# Altium project Driver_Display.PrjPcb (part 1 of 2)
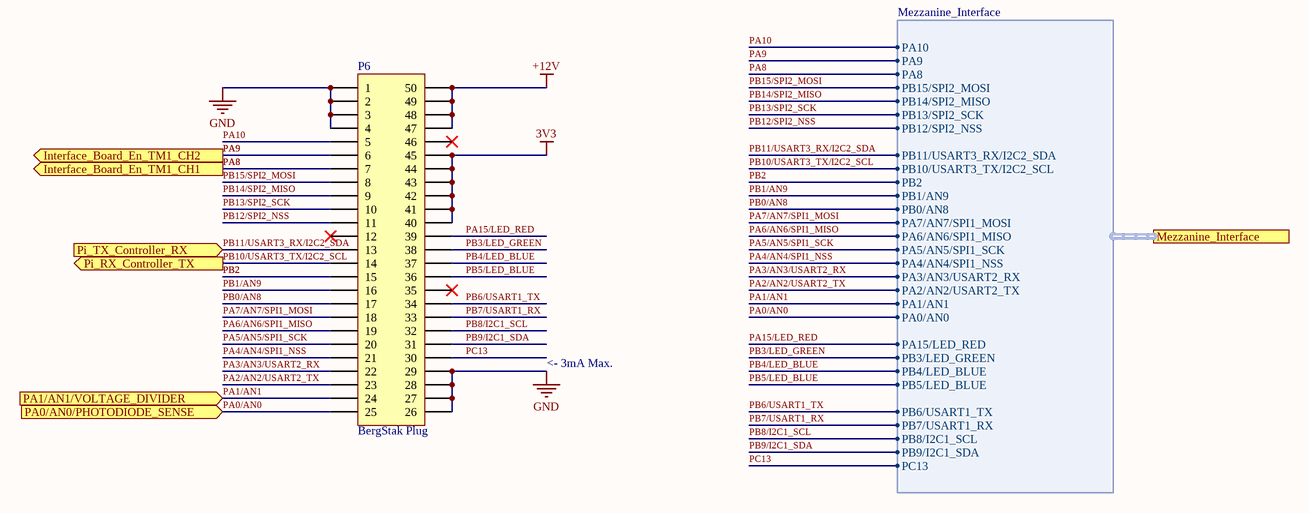
[diagram p0: Controller_Board_Interface.SchDoc]
ProjectAuthor: Kelly Tang; ProjectRevision: 1.0
5 sheets, 41 parts. Net scope: flat (ports and power ports of the same name join across sheets).
Board file: Driver_Display_Board.PcbDoc
Sheets:
  Controller_Board_Interface.SchDoc
  Voltage Regulator.SchDoc
  RTC.SchDoc
  Ambient Light Sensor.SchDoc
  Connectors.SchDoc

## Sheet Controller_Board_Interface.SchDoc
size Letter; Website: www.uwmidsun.com

### Parts
P6  Series: BergStak Plug  [CONN, Bergstak 50 Pos Plug]  (hidden comment: CONN 50POS Bergstak Plug 0.02")

### Ports
Interface_Board_En_TM1_CH1 (out), Interface_Board_En_TM1_CH2 (out), Mezzanine_Interface (harness Mezzanine_Interface), PA0/AN0/PHOTODIODE_SENSE (in), PA1/AN1/VOLTAGE_DIVIDER (in), Pi_RX_Controller_TX (out), Pi_TX_Controller_RX (in)

### Harnesses
Mezzanine_Interface: PA10, PA9, PA8, PB15/SPI2_MOSI, PB14/SPI2_MISO, PB13/SPI2_SCK, PB12/SPI2_NSS, PB11/USART3_RX/I2C2_SDA, PB10/USART3_TX/I2C2_SCL, PB2, PB1/AN9, PB0/AN8, PA7/AN7/SPI1_MOSI, PA6/AN6/SPI1_MISO, PA5/AN5/SPI1_SCK, PA4/AN4/SPI1_NSS, PA3/AN3/USART2_RX, PA2/AN2/USART2_TX, PA1/AN1, PA0/AN0, PA15/LED_RED, PB3/LED_GREEN, PB4/LED_BLUE, PB5/LED_BLUE, PB6/USART1_TX, PB7/USART1_RX, PB8/I2C1_SCL, PB9/I2C1_SDA, PC13

### Nets
3V3: P6.40 P6.41 P6.42 P6.43 P6.44 P6.45
+12V: P6.47 P6.48 P6.49 P6.50
GND: P6.1 P6.2 P6.3 P6.4 P6.26 P6.27 P6.28 P6.29
PA0/AN0: P6.25 ; port PA0/AN0/PHOTODIODE_SENSE, port Mezzanine_Interface.PA0/AN0
PA1/AN1: P6.24 ; port PA1/AN1/VOLTAGE_DIVIDER, port Mezzanine_Interface.PA1/AN1
PA2/AN2/USART2_TX: P6.23 ; port Mezzanine_Interface.PA2/AN2/USART2_TX
PA3/AN3/USART2_RX: P6.22 ; port Mezzanine_Interface.PA3/AN3/USART2_RX
PA4/AN4/SPI1_NSS: P6.21 ; port Mezzanine_Interface.PA4/AN4/SPI1_NSS
PA5/AN5/SPI1_SCK: P6.20 ; port Mezzanine_Interface.PA5/AN5/SPI1_SCK
PA6/AN6/SPI1_MISO: P6.19 ; port Mezzanine_Interface.PA6/AN6/SPI1_MISO
PA7/AN7/SPI1_MOSI: P6.18 ; port Mezzanine_Interface.PA7/AN7/SPI1_MOSI
PA8: P6.7 ; port Interface_Board_En_TM1_CH1, port Mezzanine_Interface.PA8
PA9: P6.6 ; port Interface_Board_En_TM1_CH2, port Mezzanine_Interface.PA9
PA10: P6.5 ; port Mezzanine_Interface.PA10
PA15/LED_RED: P6.39 ; port Mezzanine_Interface.PA15/LED_RED
PB0/AN8: P6.17 ; port Mezzanine_Interface.PB0/AN8
PB1/AN9: P6.16 ; port Mezzanine_Interface.PB1/AN9
PB2: P6.15 ; port Mezzanine_Interface.PB2
PB3/LED_GREEN: P6.38 ; port Mezzanine_Interface.PB3/LED_GREEN
PB4/LED_BLUE: P6.37 ; port Mezzanine_Interface.PB4/LED_BLUE
PB5/LED_BLUE: P6.36 ; port Mezzanine_Interface.PB5/LED_BLUE
PB6/USART1_TX: P6.34 ; port Mezzanine_Interface.PB6/USART1_TX
PB7/USART1_RX: P6.33 ; port Mezzanine_Interface.PB7/USART1_RX
PB8/I2C1_SCL: P6.32 ; port Mezzanine_Interface.PB8/I2C1_SCL
PB9/I2C1_SDA: P6.31 ; port Mezzanine_Interface.PB9/I2C1_SDA
PB10/USART3_TX/I2C2_SCL: P6.14 ; port Pi_RX_Controller_TX, port Mezzanine_Interface.PB10/USART3_TX/I2C2_SCL
PB11/USART3_RX/I2C2_SDA: P6.13 ; port Pi_TX_Controller_RX, port Mezzanine_Interface.PB11/USART3_RX/I2C2_SDA
PB12/SPI2_NSS: P6.11 ; port Mezzanine_Interface.PB12/SPI2_NSS
PB13/SPI2_SCK: P6.10 ; port Mezzanine_Interface.PB13/SPI2_SCK
PB14/SPI2_MISO: P6.9 ; port Mezzanine_Interface.PB14/SPI2_MISO
PB15/SPI2_MOSI: P6.8 ; port Mezzanine_Interface.PB15/SPI2_MOSI
PC13: P6.30 ; port Mezzanine_Interface.PC13

Not connected (* = marked no-connect by the designer): P6 12* 35* 46*

### Notes on the sheet
- <- 3mA Max.
- Project:
- Title:
- Size:
- Project Lead:
- Letter
- Revision:
- University of Waterloo
- 200 University Ave W
- Waterloo, ON, Canada
- N2L 3E9
- Date:
- Sheet
- of
- Website:

### Library data of the parts
P6 = CONN 50POS Bergstak Plug 0.02": 50 Position Connector Plug, Outer Shroud Contacts Surface Mount Gold; Manufacturer 1: Amphenol FCI; Manufacturer Part Number 1: 10132797-055100LF; Number of Positions: 50; Mated Stacking Heights: 5mm; Pitch: 0.020" (0.50mm); Supplier 1: Digi-Key; Supplier Part Number 1: 609-5226-1-ND; Packaging: Cut Tape (CT); Part Status: Active; Connector Type: Plug, Outer Shroud Contacts; Number of Rows: 2; Mounting Type: Surface Mount; Contact Finish: Gold; Contact Finish Thickness: 1µin (0.025µm); Height Above Board: 0.169" (4.30mm); ComponentLink1URL: http://portal.fciconnect.com/Comergent//fci/drawing/10132797.pdf; ComponentLink1Description: http://portal.fciconnect.com/Comergent//fci/drawing/10132797.pdf

## Sheet Voltage Regulator.SchDoc
size Letter; Organization: Midnight Sun Solar Rayce Car Team; Address1: University of Waterloo; Address2: 200 University Ave W; Address3: Waterloo, ON, Canada; Address4: N2L 3E9; Website: www.uwmidsun.com
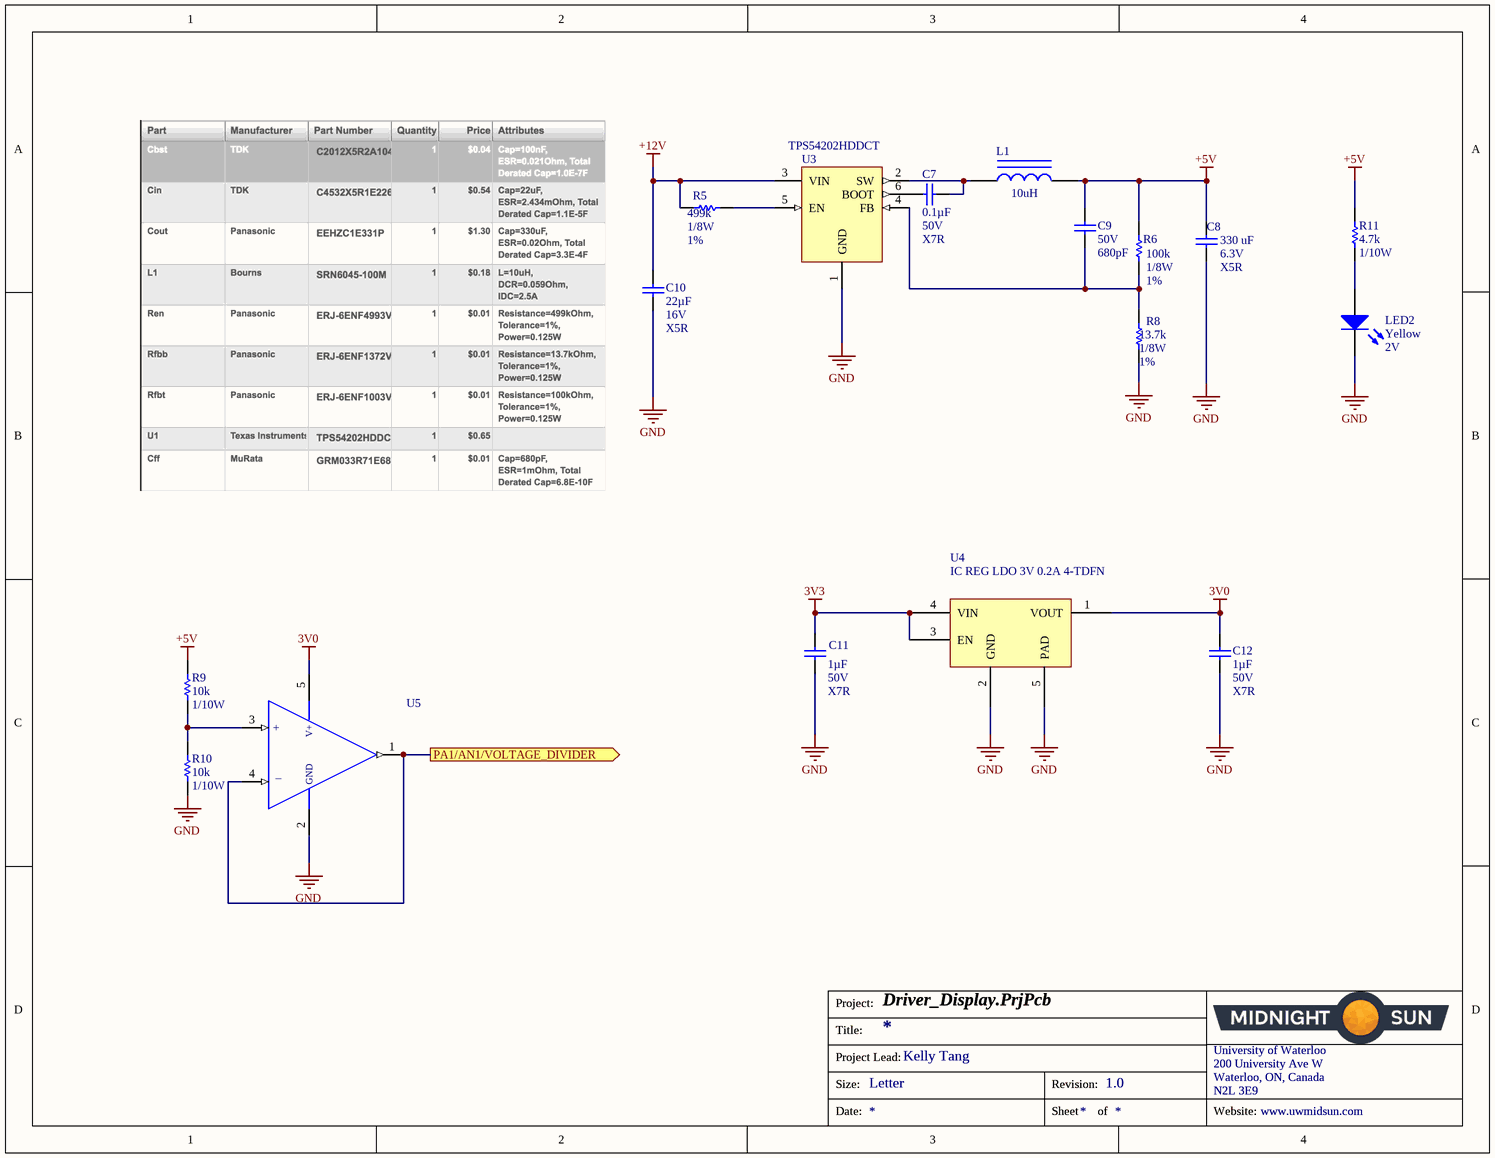
[diagram p1: Voltage Regulator.SchDoc]

### Parts
C7  Capacitance: 0.1µF  Voltage: 50V  Temperature Coefficient: X7R  [CAP, 0603]  (hidden comment: CAP CER 0.1UF 50V 10% X7R 0603)
C8  Capacitance: 330 uF  Voltage: 6.3V  Temperature Coefficient: X5R  [CAP, 1210]  (hidden comment: CAP CER 330UF 6.3V X5R 1210)
C9  Voltage: 50V  Capacitance: 680pF  [CAP, 0603]  (hidden comment: CAP CER 680PF 50V C0G/NP0 0603)
C10  Capacitance: 22µF  Voltage: 16V  Temperature Coefficient: X5R  [CAP, 1210]  (hidden comment: CAP CER 22UF 16V ±20% X5R 1210)
C11  Capacitance: 1µF  Voltage: 50V  Temperature Coefficient: X7R  [CAP, 0603]  (hidden comment: CAP CER 1UF 50V 10% X7R 0603)
C12  Capacitance: 1µF  Voltage: 50V  Temperature Coefficient: X7R  [CAP, 0603]  (hidden comment: CAP CER 1UF 50V 10% X7R 0603)
L1  Inductance: 10uH  [INDP100102X31N]  (hidden comment: IND 10UH 2.8A 59 MOHM SMD)
LED2  Color: Yellow  Voltage - Forward (Vf) (Typ): 2V  [LED_0603]  (hidden comment: LED YELLOW CLEAR 2.1V 0603)
R5  Resistance: 499k  Tolerance: 1%  Max Power Dissipation: 1/8W  [RES 1206]  (hidden comment: RES 499K OHM 1% 1/4W 1206)
R6  Tolerance: 1%  Resistance: 100k  Power Rating: 1/8W  [RES 1206]  (hidden comment: ES 100K OHM 1% 1/4W 1206)
R8  Resistance: 13.7k  Tolerance: 1%  Power Rating: 1/8W  [RES 1206]  (hidden comment: RES 13.7K OHM 1% 1/4W 1206)
R9  Resistance: 10k  Power: 1/10W  [RES, 0603]  (hidden comment: RES 10K OHM 1% 1/10W 0603)
R10  Resistance: 10k  Power: 1/10W  [RES, 0603]  (hidden comment: RES 10K OHM 1% 1/10W 0603)
R11  Resistance (Ohms): 4.7k  Power (Watts): 1/10W  [RES, 0603]  (hidden comment: RES 4.7K OHM 1% 1/10W 0603)
U3  Manufacturer Part Number: TPS54202HDDCT  [SOT23-6]  (hidden comment: IC REG BUCK ADJ 2A SYNC 6SOT)
U4  IC REG LDO 3V 0.2A 4-TDFN  [IC REG LDO 3V 0.2A 4-TDFN]
U5  IC OP AMP GEN PURPOSE RR 10MHZ SOT-23-5  [IC OP AMP GP RR 10MHZ SOT-23-5]  (value not drawn)

### Ports
PA1/AN1/VOLTAGE_DIVIDER (out)

### Nets
3V0: C12.1 U4.1(VOUT) U5.5(VDD)
3V3: C11.1 U4.3(EN) U4.4(VIN)
+5V: C8.1 C9.1 L1.2 R6.1 R9.1 R11.1
+12V: C10.1 R5.2 U3.3(VIN)
GND: C8.2 C10.2 C11.2 C12.2 LED2.2(K) R8.2 R10.2 U3.1(GND) U4.2(GND) U4.5(PAD) U5.2(VSS)
PA1/AN1: U5.1(OUTPUT) U5.4(-IN) ; port PA1/AN1/VOLTAGE_DIVIDER
NetC7_1: C7.1 U3.6(BOOT)
NetC7_2: C7.2 L1.1 U3.2(SW)
NetC9_2: C9.2 R6.2 R8.1 U3.4(FB)
NetLED2_1: LED2.1(A) R11.2
NetR5_1: R5.1 U3.5(EN)
NetR9_2: R9.2 R10.1 U5.3(+IN)

### Notes on the sheet
- Project:
- Title:
- Size:
- Project Lead:
- Letter
- Revision:
- University of Waterloo
- 200 University Ave W
- Waterloo, ON, Canada
- N2L 3E9
- Date:
- Sheet
- of
- Website:
- (in symbol IC OP AMP GEN PURPOSE RR 10MHZ SOT-23-5) V+; +; GND; _

### Library data of the parts
C7 = CAP CER 0.1UF 50V 10% X7R 0603: 0.10µF ±10% 50V Ceramic Capacitor X7R 0603 (1608 Metric); Manufacturer 1: AVX Corporation; Manufacturer Part Number 1: 06035C104KAT2A; Supplier 1: Digi-Key; Supplier Part Number 1: 478-5052-1-ND; Packaging: Cut Tape (CT); Part Status: Active; Operating Temperature: -55°C ~ 125°C; Ratings: -; Mounting Type: Surface Mount, MLCC; Package / Case: 0603 (1608 Metric); Size / Dimension: 0.063" L x 0.032" W (1.60mm x 0.81mm); Height - Seated (Max): -; Thickness (Max): 0.035" (0.90mm); Lead Spacing: -; Lead Style: -; ComponentLink1URL: http://datasheets.avx.com/X7RDielectric.pdf; ComponentLink1Description: http://datasheets.avx.com/X7RDielectric.pdf; Tolerance: ±10%
C8 = CAP CER 330UF 6.3V X5R 1210: 330µF ±20% 6.3V Ceramic Capacitor X5R 1210 (3225 Metric); Manufacturer: Taiyo Yuden; Manufacturer Part Number: JMK325ABJ337MM-P; Supplier 1: Digi-Key; Stock 1: 334; Pricing 1: 1=5.57, 10=4.492, 100=3.5039, 500=2.60546 (USD); ComponentLink1URL: http://ds.yuden.co.jp/TYCOMPAS/ut/detail.do?productNo=JMK325ABJ337MM-P&fileName=JMK325ABJ337MM-P_SS&mode=specSheetDownload; ComponentLink1Description: http://ds.yuden.co.jp/TYCOMPAS/ut/detail.do?productNo=JMK325ABJ337MM-P&fileName=JMK325ABJ337MM-P_SS&mode=specSheetDownload; Supplier Part Number 1: 587-5449-1-ND
C9 = CAP CER 680PF 50V C0G 0603: 680pF ±5% 50V Ceramic Capacitor C0G, NP0 0603 (1608 Metric); Manufacturer: Samsung; Manufacturer Part Number: CL10C681JB8NNNC; Temperature Coefficient: 300ppm/°C; Supplier 1: Digi-Key; Stock 1: 40000; Pricing 1: 1=0.16, 10=0.112, 100=0.0526, 500=0.0369, 1000=0.03055 (USD); Mount: Surface Mount; Case/Package: 0603; Case Code (Metric): 1608; Case Code (Imperial): 0603; Material: Ceramic; Min Operating Temperature: -55°C; Max Operating Temperature: 125°C; Tolerance: 5%; Packaging: Tape and Reel; Voltage Rating: 50V; Dielectric: C0G; Voltage Rating (DC): 50V; Length: 1.6mm; Height: 0.8mm; Width: 0.031inch; Thickness: 0.035inch; Depth: 0.8mm; Radiation Hardening: No; Lead Free: Lead Free; ComponentLink1URL: http://www.samsungsem.com/kr/support/product-search/mlcc/CL10C681JB8NNNC.jsp; ComponentLink1Description: http://www.samsungsem.com/kr/support/product-search/mlcc/CL10C681JB8NNNC.jsp; ComponentLink2URL: https://www.verical.com/server-webapp/html/getDatasheet?partID=359565; ComponentLink2Description: https://www.verical.com/server-webapp/html/getDatasheet?partID=359565; ComponentLink3URL: http://www1.futureelectronics.com/doc/SAMSUNG%20PASSIVE/CL05B104KQ5NNNC.pdf; ComponentLink3Description: http://www1.futureelectronics.com/doc/SAMSUNG%20PASSIVE/CL05B104KQ5NNNC.pdf; ComponentLink4URL: http://www.rapidonline.com/pdf/71-0310.pdf; ComponentLink4Description: http://www.rapidonline.com/pdf/71-0310.pdf; ComponentLink5URL: https://www.distrelec.biz/Web/Downloads/_e/ng/MLCC_CatalogDownload2013_ENG.pdf?mime=application%2Fpdf; ComponentLink5Description: https://www.distrelec.biz/Web/Downloads/_e/ng/MLCC_CatalogDownload2013_ENG.pdf?mime=application%2Fpdf; ComponentLink6URL: https://produktinfo.conrad.com/datenblaetter/450000-474999/456146-da-01-en-VS_KONDENSATOR_0603.pdf; ComponentLink6Description: https://produktinfo.conrad.com/datenblaetter/450000-474999/456146-da-01-en-VS_KONDENSATOR_0603.pdf; Supplier Part Number 1: 1276-1820-1-ND
C10 = CAP CER 22UF 16V ±20% X5R 1210: 22µF ±20% 16V Ceramic Capacitor X5R 1210 (3225 Metric); Manufacturer 1: Murata Electronics North America; Manufacturer Part Number 1: GRM32ER61C226ME20L; Supplier 1: Digi-Key; Supplier Part Number 1: 490-1881-1-ND; Packaging: Cut Tape (CT); Part Status: Active; Operating Temperature: -55°C ~ 85°C; Ratings: -; Mounting Type: Surface Mount, MLCC; Package / Case: 1210 (3225 Metric); Size / Dimension: 0.126" L x 0.098" W (3.20mm x 2.50mm); Height - Seated (Max): -; Thickness (Max): 0.106" (2.70mm); Lead Spacing: -; Lead Style: -; ComponentLink1URL: http://www.murata.com/~/media/webrenewal/support/library/catalog/products/capacitor/mlcc/c02e.ashx; ComponentLink1Description: http://www.murata.com/~/media/webrenewal/support/library/catalog/products/capacitor/mlcc/c02e.ashx; Tolerance: ±20%
C11 C12 = CAP CER 1UF 50V 10% X7R 0603: 1µF ±10% 50V Ceramic Capacitor X7R 0603 (1608 Metric); Manufacturer 1: Taiyo Yuden; Manufacturer Part Number 1: UMK107AB7105KA-T; Supplier 1: Digi-Key; Supplier Part Number 1: 587-3247-1-ND; Packaging: Cut Tape (CT); Part Status: Active; Operating Temperature: -55°C ~ 125°C; Ratings: -; Mounting Type: Surface Mount, MLCC; Package / Case: 0603 (1608 Metric); Size / Dimension: 0.063" L x 0.031" W (1.60mm x 0.80mm); Height - Seated (Max): -; Thickness (Max): 0.037" (0.95mm); Lead Spacing: -; Lead Style: -; ComponentLink1URL: http://www.yuden.co.jp/productdata/catalog/en/mlcc_all_e.pdf; ComponentLink1Description: http://www.yuden.co.jp/productdata/catalog/en/mlcc_all_e.pdf; Tolerance: ±10%
L1 = IND 10UH 2.8A 59 MOHM SMD: 10µH Shielded Inductor 2.8A 59 mOhm Max Nonstandard; Manufacturer: Sumida; Manufacturer Part Number: CDRH103RNP-100NC-B; Core Material: Ferrite; Tolerance: 30%; Saturation Current: 3.18A; DC Resistance (DCR): 59mR; Test Frequency: 100kHz; Supplier 1: Digi-Key; Stock 1: 69; Pricing 1: 1=1.53, 10=1.42, 100=1.027, 500=0.7866 (USD); Mount: Surface Mount; Case/Package: Nonstandard; Min Operating Temperature: -40°C; Max Operating Temperature: 100°C; Packaging: Tape and Reel; Package Quantity: 1000; Current Rating: 2.8A; Shielding: Shielded; Max DC Current: 2.8A; Termination: SMD/SMT; Length: 0.402inch; Height: 3.1mm; Width: 0.394inch; Height - Seated (Max): 0.122inch; Depth: 10.3mm; Radiation Hardening: No; Lead Free: Lead Free; ComponentLink1URL: http://www.mouser.com/ds/2/390/CDRH103R-523372.pdf; ComponentLink1Description: http://www.mouser.com/ds/2/390/CDRH103R-523372.pdf; ComponentLink2URL: http://www.sumida.com/products/pdf/CDRH103R.pdf; ComponentLink2Description: http://www.sumida.com/products/pdf/CDRH103R.pdf; ComponentLink3URL: http://products.sumida.com/products/pdf/CDRH103R.pdf; ComponentLink3Description: http://products.sumida.com/products/pdf/CDRH103R.pdf; Supplier Part Number 1: 308-1910-1-ND
LED2 = LED YELLOW CLEAR 2.1V 0603: Yellow 590nm LED Indication - Discrete 2V 0603 (1608 Metric); Manufacturer: Wurth Electronics Inc.; Manufacturer Part Number: 150060YS75000; Lens Color: Colorless; Millicandela Rating: 120mcd; Lens Style/Size: Rectangle with Flat Top, 1.10mm x 0.70mm; Current - Test: 20mA; Viewing Angle: 140°; Wavelength - Peak: 595nm; Supplier 1: Digi-Key; RoHS: RoHS Compliant; Category: Optoelectronics; Stock 1: 10523; Pricing 1: 1=0.21, 100=0.1617, 500=0.13964 (CAD); Packaging: Cut Tape (CT); Part Status: Active; Lens Transparency: Clear; Mounting Type: Surface Mount; Wavelength - Dominant: 590nm; Features: -; Package / Case: 0603 (1608 Metric); Supplier Device Package: 0603; Size / Dimension: 1.60mm L x 0.80mm W; Height (Max): 0.80mm; ComponentLink1URL: http://katalog.we-online.de/led/datasheet/150060YS75000.pdf; ComponentLink1Description: http://katalog.we-online.de/led/datasheet/150060YS75000.pdf; Supplier Part Number 1: 732-4981-1-ND
R5 = RES 499K OHM 1% 1/4W 1206: Manufacturer: Stackpole Electronics; Manufacturer Part Number: RMCF1206FT499K; Temperature Coefficient: 100ppm/°C; Supplier 1: Digi-Key; Stock 1: 60246; Pricing 1: 1=0.1, 10=0.035, 100=0.0141, 1000=0.00635, 2500=0.00552 (USD); Mount: Surface Mount; Case/Package: 1206; Case Code (Metric): 3216; Case Code (Imperial): 1206; Contact Plating: Tin,Matte; Min Operating Temperature: -55°C; Max Operating Temperature: 155°C; Packaging: Tape and Reel; Composition: Thick Film; Number of Terminations: 2; Length: 0.126inch; Height: 0.028inch; Width: 0.063inch; Radiation Hardening: No; ComponentLink1URL: https://www.seielect.com/Catalog/SEI-RMCF_RMCP.pdf; ComponentLink1Description: https://www.seielect.com/Catalog/SEI-RMCF_RMCP.pdf; ComponentLink2URL: http://components.arrow.com/part/dataview/50498553S9833735N1174; ComponentLink2Description: http://components.arrow.com/part/dataview/50498553S9833735N1174; Supplier Part Number 1: RMCF1206FT499KCT-ND
R6 = RES 100K OHM 1% 1/4W 1206: 100 kOhms ±1% 0.25W, 1/4W Chip Resistor 1206 (3216 Metric) Moisture Resistant Thick Film; Manufacturer: Yageo; Manufacturer Part Number: RC1206FR-07100KL; Temperature Coefficient: 100ppm/°C; Voltage Rating: 200V; Supplier 1: Digi-Key; Stock 1: 1498131; Pricing 1: 1=0.1, 10=0.033, 100=0.0136, 1000=0.0061, 2500=0.00529 (USD); Case/Package: 1206; Case Code (Imperial): 1206; Case Code (Metric): 3216; Min Operating Temperature: -55°C; Max Operating Temperature: 155°C; Packaging: Tape and Reel; Termination: SMD/SMT; Composition: Thick Film; Length: 3.1mm; Height: 0.55mm; Depth: 1.6mm; REACH SVHC: No SVHC; Lead Free: Lead Free; ComponentLink1URL: https://datasheet.ciiva.com/7857/444357-7857239.pdf; ComponentLink1Description: https://datasheet.ciiva.com/7857/444357-7857239.pdf; ComponentLink2URL: https://datasheet.ciiva.com/7857/444357-7857240.pdf; ComponentLink2Description: https://datasheet.ciiva.com/7857/444357-7857240.pdf; ComponentLink3URL: https://datasheet.ciiva.com/16997/pyu-rc1206-51-rohs-l-4-16997053.pdf; ComponentLink3Description: https://datasheet.ciiva.com/16997/pyu-rc1206-51-rohs-l-4-16997053.pdf; Supplier Part Number 1: 311-100KFRCT-ND
R8 = RES 13.7K OHM 1% 1/4W 1206: 13.7 kOhms ±1% 0.25W, 1/4W Chip Resistor 1206 (3216 Metric) Moisture Resistant Thick Film; Manufacturer: Yageo; Manufacturer Part Number: RC1206FR-0713K7L; Voltage Rating: 200V; Temperature Coefficient: 100ppm/°C; Supplier 1: Digi-Key; Stock 1: 44928; Pricing 1: 1=0.1, 10=0.033, 100=0.0136, 1000=0.0061, 2500=0.00529 (USD); Case/Package: 1206; Case Code (Imperial): 1206; Case Code (Metric): 3216; Contact Plating: Tin,Matte; Min Operating Temperature: -55°C; Max Operating Temperature: 155°C; Packaging: Tape and Reel; Termination: SMD/SMT; Composition: Thick Film; Military Standard: Not; Voltage Rating (DC): 200V; Length: 3.1mm; Height: 0.55mm; Width: 1.6mm; Depth: 1.6mm; Radiation Hardening: No; Lead Free: Lead Free; ComponentLink1URL: http://components.arrow.com/part/dataview/0323_03537901; ComponentLink1Description: http://components.arrow.com/part/dataview/0323_03537901; ComponentLink2URL: http://www.yageo.com/documents/recent/PYu-RC_Group_51_RoHS_L_2.pdf; ComponentLink2Description: http://www.yageo.com/documents/recent/PYu-RC_Group_51_RoHS_L_2.pdf; ComponentLink3URL: http://www.yageo.com/documents/recent/PYu-RC1206_51_RoHS_L-4.pdf; ComponentLink3Description: http://www.yageo.com/documents/recent/PYu-RC1206_51_RoHS_L-4.pdf; ComponentLink4URL: http://www.yageo.com.tw/exep/pages/download/literatures/PYu-R_INT-thick_7.pdf; ComponentLink4Description: http://www.yageo.com.tw/exep/pages/download/literatures/PYu-R_INT-thick_7.pdf; ComponentLink5URL: http://www.mouser.com/ds/2/447/PYu-RC1206_51_RoHS_L-4-349080.pdf; ComponentLink5Description: http://www.mouser.com/ds/2/447/PYu-RC1206_51_RoHS_L-4-349080.pdf; ComponentLink6URL: http://www.yageo.com/documents/recent/PYu-RC1206_51_RoHS_L_5.pdf; ComponentLink6Description: http://www.yageo.com/documents/recent/PYu-RC1206_51_RoHS_L_5.pdf; Supplier Part Number 1: 311-13.7KFRCT-ND
R9 R10 = RES 10K OHM 1% 1/10W 0603: RES SMD 10K OHM 1% 1/10W 0603; Manufacturer 1: Yageo; Manufacturer Part Number 1: RC0603FR-0710KL; Temperature Coefficient: ±100ppm/°C; Supplier 1: Digi-Key; Supplier Part Number 1: 311-10.0KHRCT-ND; Packaging: Cut Tape (CT); Part Status: Active; Composition: Thick Film; Operating Temperature: -55°C ~ 155°C; Package / Case: 0603 (1608 Metric); Supplier Device Package: 0603; Size / Dimension: 0.063" L x 0.031" W (1.60mm x 0.80mm); Height - Seated (Max): 0.022" (0.55mm); Failure Rate: -; ComponentLink1URL: http://www.yageo.com/documents/recent/PYu-RC_Group_51_RoHS_L_7.pdf; ComponentLink1Description: http://www.yageo.com/documents/recent/PYu-RC_Group_51_RoHS_L_7.pdf; Tolerance: ±1%
R11 = RES 4.7K OHM 1% 1/10W 0603: 4.7k Ohm ±1% 0.1W, 1/10W Chip Resistor 0603 (1608 Metric) Moisture Resistant Thick Film; Manufacturer 1: Yageo; Manufacturer Part Number 1: RC0603FR-074K7L; Description 1: RES SMD 4.7K OHM 1% 1/10W 0603; Temperature Coefficient: ±100ppm/°C; Supplier 1: Digi-Key; Supplier Part Number 1: 311-4.70KHRCT-ND; RoHS: RoHS Compliant; Category: Resistors; Stock 1: 3487566; Pricing 1: 1=0.16, 10=0.022, 100=0.0089, 1000=0.00402, 2500=0.00349 (CAD); Packaging: Cut Tape (CT); Part Status: Active; Composition: Thick Film; Features: Moisture Resistant; Operating Temperature: -55°C ~ 155°C; Package / Case: 0603 (1608 Metric); Supplier Device Package: 0603; Size / Dimension: 0.063" L x 0.031" W (1.60mm x 0.80mm); Height - Seated (Max): 0.022" (0.55mm); Failure Rate: -; ComponentLink1URL: http://www.yageo.com/documents/recent/PYu-RC_Group_51_RoHS_L_7.pdf; ComponentLink1Description: http://www.yageo.com/documents/recent/PYu-RC_Group_51_RoHS_L_7.pdf; Tolerance: ±1%
U3 = IC REG BUCK ADJ 2A SYNC 6SOT: Buck Switching Regulator IC Positive Adjustable 0.596V 1 Output 2A SOT-23-6 Thin, TSOT-23-6; Manufacturer: Texas Instruments; Min Input Voltage: 4.5V; Max Input Voltage: 28V; Number of Outputs: 1; Min Output Voltage: 600mV; Max Output Voltage: 26V; Switching Frequency: 500kHz; Quiescent Current: 40uA; Supplier 1: Digi-Key; Stock 1: 2574; Pricing 1: 1=2, 10=1.796, 100=1.4436 (USD); Case/Package: SOT-6; Number of Pins: 6; Min Operating Temperature: -40°C; Max Operating Temperature: 125°C; Output Current: 2A; Packaging: Cut Tape; Output Voltage: 26V; REACH SVHC: No SVHC; Lead Free: Lead Free; ComponentLink1URL: http://www.ti.com/lit/ds/symlink/tps54202h.pdf; ComponentLink1Description: http://www.ti.com/lit/ds/symlink/tps54202h.pdf; ComponentLink2URL: http://www.ti.com/general/docs/lit/getliterature.tsp?genericPartNumber=TPS54202H&amp;&amp;fileType=pdf; ComponentLink2Description: http://www.ti.com/general/docs/lit/getliterature.tsp?genericPartNumber=TPS54202H&amp;&amp;fileType=pdf; ComponentLink3URL: http://www.ti.com/general/docs/lit/getliterature.tsp?genericPartNumber=TPS54202H&&fileType=pdf; ComponentLink3Description: http://www.ti.com/general/docs/lit/getliterature.tsp?genericPartNumber=TPS54202H&&fileType=pdf; Supplier Part Number 1: 296-44497-1-ND
U4 = IC REG LDO 3V 0.2A 4-TDFN: Manufacturer: Microchip Technology; Manufacturer Part Number: MIC94310-PYMT-TR; Regulator Topology: Positive Fixed; Current - Output: 200mA; Voltage - Dropout (Typical): 0.04V @ 200mA; Voltage - Input: Up to 3.6V; Current - Limit (Min): 250mA; Supplier 1: Digi-Key; RoHS: RoHS Compliant; Category: Integrated Circuits (ICs); Stock 1: 4802; Pricing 1: 1=0.45, 25=0.3708, 100=0.3386 (CAD); Packaging: Cut Tape (CT); Part Status: Active; Voltage - Output: 3V; Operating Temperature: -40°C ~ 125°C; Mounting Type: Surface Mount; Package / Case: 4-UFDFN Exposed Pad; Supplier Device Package: 4-TDFN (1.2x1.6); ComponentLink1URL: http://www.microchip.com/mymicrochip/filehandler.aspx?ddocname=en580409; ComponentLink1Description: http://www.microchip.com/mymicrochip/filehandler.aspx?ddocname=en580409; Supplier Part Number 1: 576-4761-1-ND
U5 = IC OP AMP GEN PURPOSE RR 10MHZ SOT-23-5: General Purpose Amplifier 1 Circuit Rail-to-Rail SOT-23-5; Manufacturer 1: Texas Instruments; Manufacturer Part Number 1: TLV316QDBVRQ1; Description 1: IC OP AMP GP RR 10MHZ 5-SOT-23; Number of Circuits: 1; Slew Rate: 6 V/µs; Current - Supply: 400µA; Current - Output / Channel: 50mA; Voltage - Supply, Single/Dual (±): 1.8 V ~ 5.5 V, ±0.9 V ~ 2.75 V; Supplier 1: Digi-Key; Supplier Part Number 1: 296-45323-1-ND; RoHS: RoHS Compliant; Category: Integrated Circuits (ICs); Stock 1: 1747; Pricing 1: 1=1.33, 10=1.185, 100=0.9234, 500=0.76276, 1000=0.60218 (CAD); Packaging: Cut Tape (CT); Part Status: Active; Amplifier Type: General Purpose; Output Type: Rail-to-Rail; -3db Bandwidth: -; Operating Temperature: -40°C ~ 125°C; Mounting Type: Surface Mount; Package / Case: SC-74A, SOT-753; Supplier Device Package: SOT-23-5; ComponentLink1URL: http://www.ti.com/lit/ds/symlink/tlv316-q1.pdf; ComponentLink1Description: http://www.ti.com/lit/ds/symlink/tlv316-q1.pdf

## Sheet RTC.SchDoc
size Letter; Organization: Midnight Sun Solar Rayce Car Team; Address1: University of Waterloo; Address2: 200 University Ave W; Address3: Waterloo, ON, Canada; Address4: N2L 3E9; Website: www.uwmidsun.com
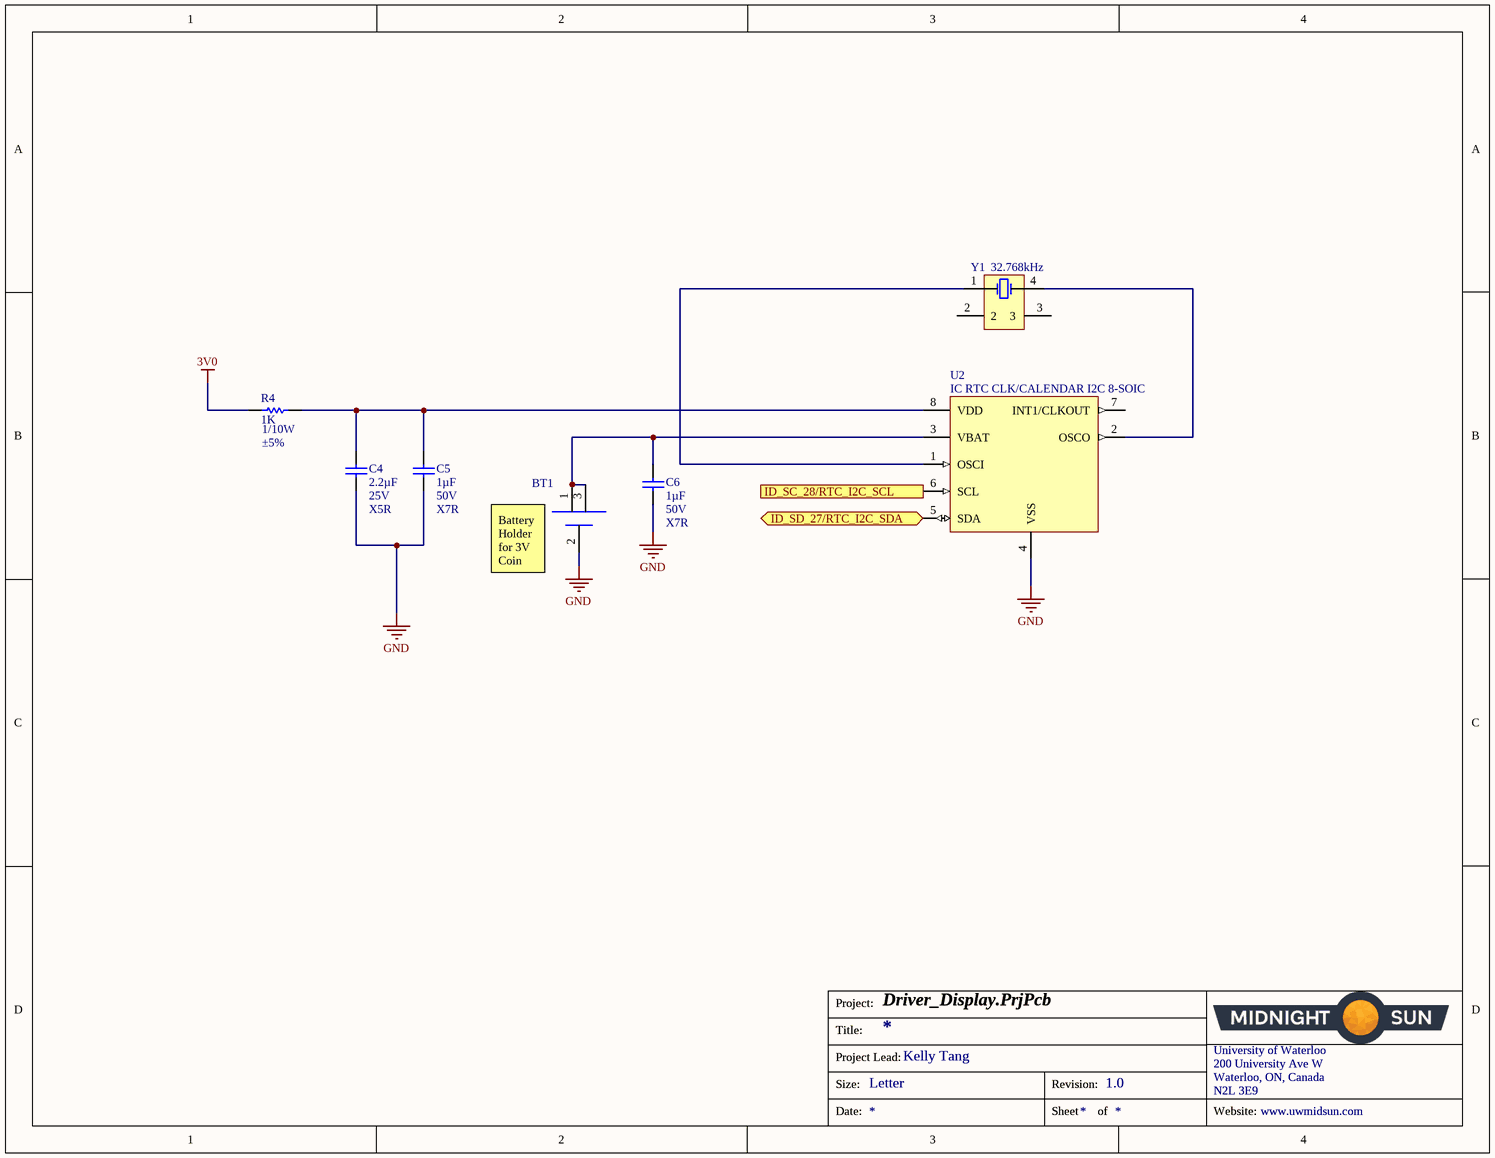
[diagram p2: RTC.SchDoc]

### Parts
BT1  HOLDER BATTERY COIN 12MM DIA  [HOLDER COIN CELL 1220 3V]  (value not drawn)
C4  Capacitance: 2.2µF  Voltage: 25V  Temperature Coefficient: X5R  [CAP, 0603]  (hidden comment: CAP CER 2.2UF 25V 10% X5R 0603)
C5  Capacitance: 1µF  Voltage: 50V  Temperature Coefficient: X7R  [CAP, 0603]  (hidden comment: CAP CER 1UF 50V 10% X7R 0603)
C6  Capacitance: 1µF  Voltage: 50V  Temperature Coefficient: X7R  [CAP, 0603]  (hidden comment: CAP CER 1UF 50V 10% X7R 0603)
R4  1K  Tolerance: ±5%  Power (Watts): 1/10W  [RES, 0603]
U2  IC RTC CLK/CALENDAR I2C 8-SOIC  [SOIC8]
Y1  Frequency: 32.768kHz  [4-SOJ]  (hidden comment: CRYSTAL 32.7680KHZ 12.5PF SMD)

### Ports
ID_SC_28/RTC_I2C_SCL (in), ID_SD_27/RTC_I2C_SDA (bidir)

### Nets
3V0: R4.1
GND: BT1.2(negative) C4.2 C5.2 C6.2 U2.4(VSS)
NetBT1_1: BT1.1(positive_1) BT1.3(positive_2) C6.1 U2.3(VBAT)
NetC4_1: C4.1 C5.1 R4.2 U2.8(VDD)
NetP3_27: U2.5(SDA) ; port ID_SD_27/RTC_I2C_SDA
NetP3_28: U2.6(SCL) ; port ID_SC_28/RTC_I2C_SCL
NetU2_1: U2.1(OSCI) Y1.1
NetU2_2: U2.2(OSCO) Y1.4

Not connected (* = marked no-connect by the designer): U2 7(INT1/CLKOUT); Y1 2 3

### Notes on the sheet
- (near BT1) Battery Holder for 3V Coin Cell
- Project:
- Title:
- Size:
- Project Lead:
- Letter
- Revision:
- University of Waterloo
- 200 University Ave W
- Waterloo, ON, Canada
- N2L 3E9
- Date:
- Sheet
- of
- Website:

### Library data of the parts
BT1 = HOLDER BATTERY COIN 12MM DIA: Coin cell holder smd; Manufacturer: Keystone Electronics; Manufacturer Part Number: 3000; Body Material: Bronze; Number of Batteries: 1; Supplier 1: Digi-Key; Stock 1: 17093; Pricing 1: 1=0.58, 10=0.545, 50=0.4356, 100=0.4175, 250=0.38116, 500=0.363, 1000=0.30495, 2500=0.27225, 5000=0.26318 (USD); Mount: Surface Mount,PCB; Contact Material: Bronze,Nickel; Material: Bronze; Contact Plating: Nickel; Package Quantity: 100; Packaging: Bulk; Termination: SMD/SMT; Number of Cells: 1; Diameter: 12mm; Height: 3.17mm; REACH SVHC: No SVHC; Lead Free: Lead Free; ComponentLink1URL: https://datasheet.ciiva.com/3/3000-3953.pdf; ComponentLink1Description: https://datasheet.ciiva.com/3/3000-3953.pdf; ComponentLink2URL: https://datasheet.ciiva.com/11714/0900766b8002ef78-11714721.pdf; ComponentLink2Description: https://datasheet.ciiva.com/11714/0900766b8002ef78-11714721.pdf; ComponentLink3URL: https://datasheet.ciiva.com/20221/18-3570e-20221596.pdf; ComponentLink3Description: https://datasheet.ciiva.com/20221/18-3570e-20221596.pdf; ComponentLink4URL: https://datasheet.ciiva.com/1391/1718262-1391630.pdf; ComponentLink4Description: https://datasheet.ciiva.com/1391/1718262-1391630.pdf; Supplier Part Number 1: 36-3000-ND
C4 = CAP CER 2.2UF 25V 10% X5R 0603: 2.2µF ±10% 25V Ceramic Capacitor X5R 0603 (1608 Metric); Manufacturer 1: Murata Electronics North America; Manufacturer Part Number 1: GRM188R61E225KA12D; Supplier 1: Digi-Key; Supplier Part Number 1: 490-10731-1-ND; Packaging: Cut Tape (CT); Part Status: Active; Operating Temperature: -55°C ~ 85°C; Ratings: -; Mounting Type: Surface Mount, MLCC; Package / Case: 0603 (1608 Metric); Size / Dimension: 0.063" L x 0.031" W (1.60mm x 0.80mm); Height - Seated (Max): -; Thickness (Max): 0.035" (0.90mm); Lead Spacing: -; Lead Style: -; ComponentLink1URL: http://www.murata.com/~/media/webrenewal/support/library/catalog/products/capacitor/mlcc/c02e.ashx; ComponentLink1Description: http://www.murata.com/~/media/webrenewal/support/library/catalog/products/capacitor/mlcc/c02e.ashx; Tolerance: ±10%
C5 C6 = CAP CER 1UF 50V 10% X7R 0603: as C11 on sheet Voltage Regulator; Supplier 1: Digi-Key; Supplier Part Number 1: 587-3247-1-ND; Packaging: Cut Tape (CT); Part Status: Active; Operating Temperature: -55°C ~ 125°C; Ratings: -; Mounting Type: Surface Mount, MLCC; Package / Case: 0603 (1608 Metric); Size / Dimension: 0.063" L x 0.031" W (1.60mm x 0.80mm); Height - Seated (Max): -; Thickness (Max): 0.037" (0.95mm); Lead Spacing: -; Lead Style: -; ComponentLink1URL: http://www.yuden.co.jp/productdata/catalog/en/mlcc_all_e.pdf; ComponentLink1Description: http://www.yuden.co.jp/productdata/catalog/en/mlcc_all_e.pdf; Tolerance: ±10%
R4 = RES 1K OHM 5% 1/10W 0603: 1k Ohm ±5% 0.1W, 1/10W Chip Resistor 0603 (1608 Metric); Manufacturer: Yageo; Manufacturer Part Number: RC0603JR-071KL; Temperature Coefficient: ±100ppm/°C; Supplier 1: Digi-Key; Supplier Part Number 1: 311-1.0KGRCT-ND; RoHS: RoHS Compliant; Category: Resistors; Stock 1: 4415240; Pricing 1: 1=0.15, 10=0.017, 100=0.0071, 1000=0.0032, 2500=0.00278 (CAD); Packaging: Cut Tape (CT); Part Status: Active; Resistance (Ohms): 1k; Composition: Thick Film; Features: Moisture Resistant; Operating Temperature: -55°C ~ 155°C; Package / Case: 0603 (1608 Metric); Supplier Device Package: 0603; Size / Dimension: 0.063" L x 0.031" W (1.60mm x 0.80mm); Height - Seated (Max): 0.022" (0.55mm); Failure Rate: -; ComponentLink1URL: http://www.yageo.com/documents/recent/PYu-RC_Group_51_RoHS_L_7.pdf; ComponentLink1Description: http://www.yageo.com/documents/recent/PYu-RC_Group_51_RoHS_L_7.pdf
U2 = IC RTC CLK/CALENDAR I2C 8-SOIC: Real Time Clock (RTC) IC Clock/Calendar I²C, 2-Wire Serial 8-SOIC (0.154", 3.90mm Width); Manufacturer: NXP Semiconductors; Manufacturer Part Number: PCF8523T/1,118; Min Supply Voltage: 1.2V; Max Supply Voltage: 5.5V; Time Format: HH:MM:SS; Supplier 1: Digi-Key; Stock 1: 18252; Pricing 1: 1=1.3, 10=1.16, 100=0.9045, 500=0.74718, 1000=0.58988 (USD); Mount: Surface Mount; Case/Package: SO; Number of Pins: 8; Contact Plating: Gold; Min Operating Temperature: -40°C; Max Operating Temperature: 85°C; Packaging: Tape and Reel; Interface: I2C; Package Quantity: 2500; Logic Function: Clock; Radiation Hardening: No; REACH SVHC: No SVHC; Lead Free: Lead Free; ComponentLink1URL: https://datasheet.ciiva.com/15152/getdatasheetpartid-445247-15152839.pdf; ComponentLink1Description: https://datasheet.ciiva.com/15152/getdatasheetpartid-445247-15152839.pdf; ComponentLink2URL: https://datasheet.ciiva.com/1238/pcf8523-1238780.pdf; ComponentLink2Description: https://datasheet.ciiva.com/1238/pcf8523-1238780.pdf; ComponentLink3URL: https://datasheet.ciiva.com/1238/pcf8523-1238781.pdf; ComponentLink3Description: https://datasheet.ciiva.com/1238/pcf8523-1238781.pdf; ComponentLink4URL: https://datasheet.ciiva.com/16286/pcf8523-16286477.pdf; ComponentLink4Description: https://datasheet.ciiva.com/16286/pcf8523-16286477.pdf; ComponentLink5URL: https://datasheet.ciiva.com/1238/pcf8523-1238782.pdf; ComponentLink5Description: https://datasheet.ciiva.com/1238/pcf8523-1238782.pdf; Supplier Part Number 1: 568-5306-1-ND
Y1 = CRYSTAL 32.7680KHZ 12.5PF SMD: 32.768kHz ±20ppm Crystal 12.5pF 50 kOhms 4-SOJ, 5.50mm pitch; Manufacturer: ECS International; Manufacturer Part Number: ECS-.327-12.5-17X-TR; ESR (Equivalent Series Resistance): 50kR; Supplier 1: Digi-Key; Stock 1: 67622; Pricing 1: 1=0.56, 10=0.468, 50=0.4208, 100=0.374, 500=0.3553, 1000=0.2992 (USD); Mount: Surface Mount; Min Operating Temperature: -40°C; Max Operating Temperature: 85°C; Package Quantity: 1; Frequency Tolerance: 20ppm; Load Capacitance: 12.5pF; Packaging: Tape and Reel; Tolerance: 20ppm; Termination: SMD/SMT; Length: 0.315inch; Height: 0.098inch; Width: 0.15inch; Lead Free: Lead Free; ComponentLink1URL: https://datasheet.ciiva.com/852/ecx-306x-852775.pdf; ComponentLink1Description: https://datasheet.ciiva.com/852/ecx-306x-852775.pdf; ComponentLink2URL: https://datasheet.ciiva.com/852/ecx-306x-852776.pdf; ComponentLink2Description: https://datasheet.ciiva.com/852/ecx-306x-852776.pdf; ComponentLink3URL: https://datasheet.ciiva.com/852/ecx-306x-852777.pdf; ComponentLink3Description: https://datasheet.ciiva.com/852/ecx-306x-852777.pdf; Supplier Part Number 1: XC1195CT-ND

## Sheet Ambient Light Sensor.SchDoc
size Letter; Organization: Midnight Sun Solar Rayce Car Team; Address1: University of Waterloo; Address2: 200 University Ave W; Address3: Waterloo, ON, Canada; Address4: N2L 3E9; Website: www.uwmidsun.com
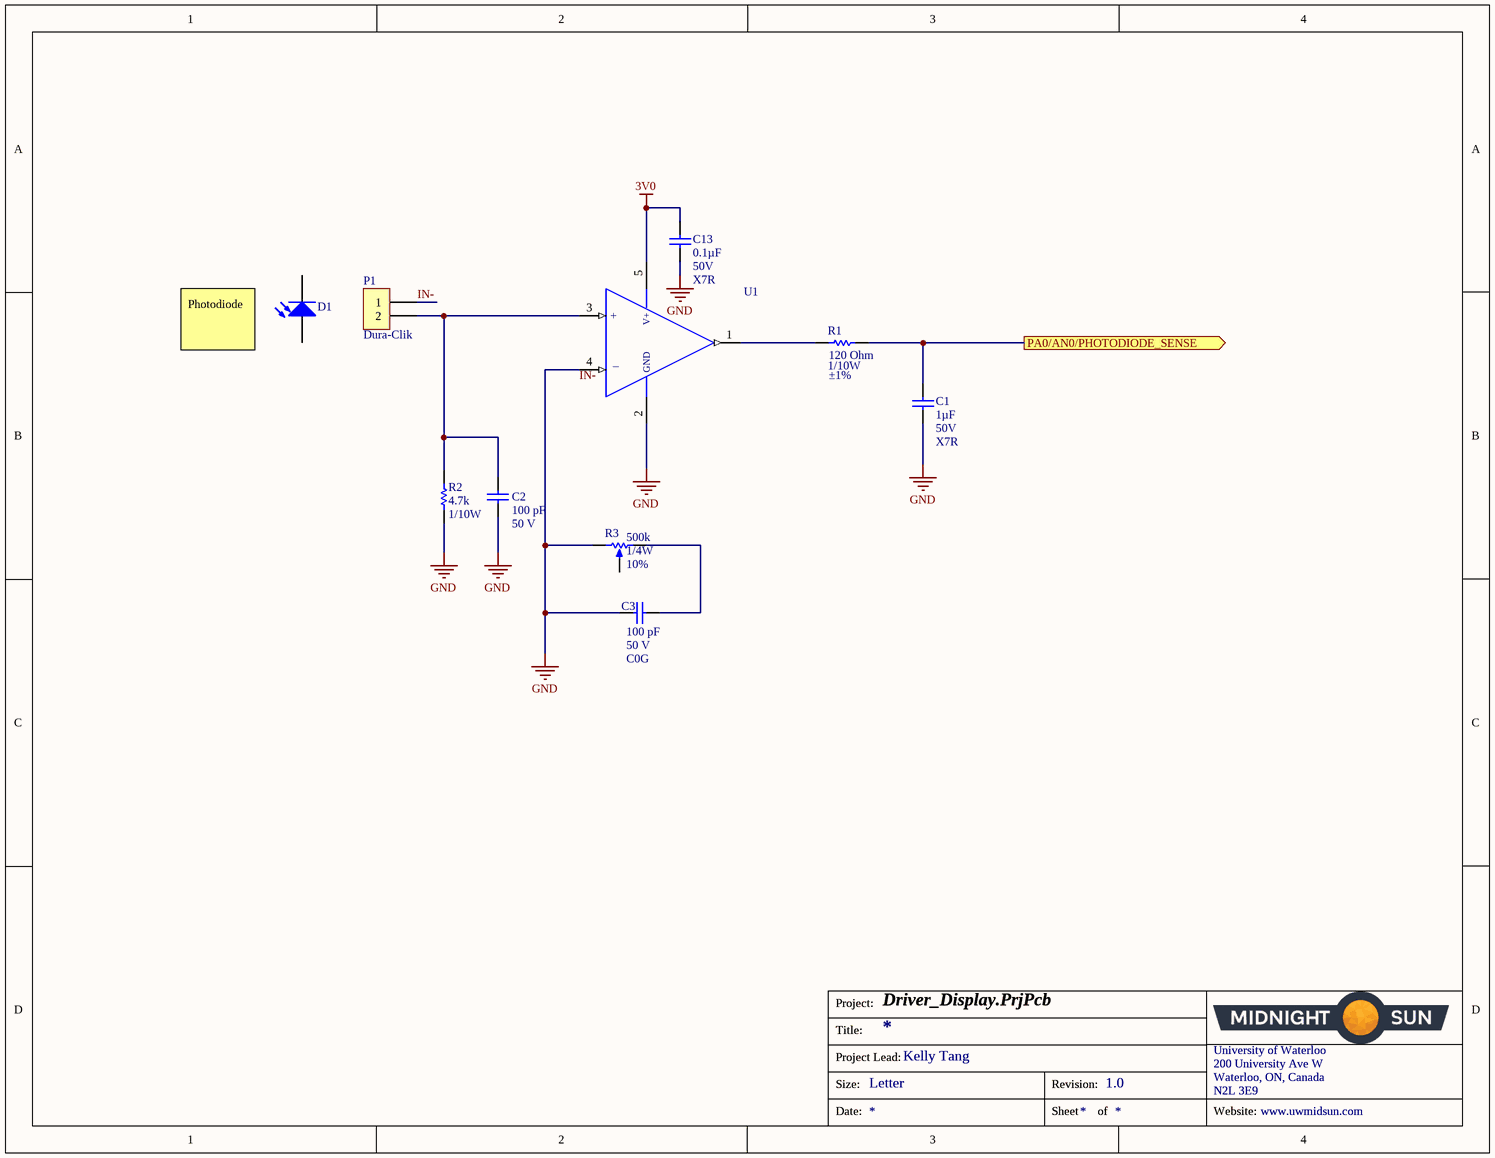
[diagram p3: Ambient Light Sensor.SchDoc]

### Parts
C1  Capacitance: 1µF  Voltage: 50V  Temperature Coefficient: X7R  [CAP, 0603]  (hidden comment: CAP CER 1UF 50V 10% X7R 0603)
C2  CAP CER 100PF 50V C0G/NP0 0603  [CAP, 0603]  (value not drawn)
C3  Dielectric: C0G  [CAP, 0603]  (hidden comment: CAP CER 100PF 50V C0G/NP0 0603)
C13  Capacitance: 0.1µF  Voltage: 50V  Temperature Coefficient: X7R  [CAP, 0603]  (hidden comment: CAP CER 0.1UF 50V 10% X7R 0603)
D1  DIODE 880NM W/FLTR THRUHOLE  (value not drawn)  (graphical)
P1  Dura-Clik  [CONN, 2POS Dura-Click Vertical]
R1  Tolerance: ±1%  Resistance: 120 Ohm  Power: 1/10W  [RES, 0603]  (hidden comment: RES 120 OHM 1% 1/10W 0603)
R2  Resistance (Ohms): 4.7k  Power (Watts): 1/10W  [RES, 0603]  (hidden comment: RES 4.7K OHM 1% 1/10W 0603)
R3  Tolerance: 10%  Max Power Dissipation: 1/4W  Resistance: 500k  [POT TRIMMER 500k]  (hidden comment: POT 500K OHM 0.25W SMD)
U1  IC OP AMP GEN PURPOSE RR 10MHZ SOT-23-5  [IC OP AMP GP RR 10MHZ SOT-23-5]  (value not drawn)

### Ports
PA0/AN0/PHOTODIODE_SENSE (out)

### Nets
3V0: C13.1 U1.5(VDD)
GND: C1.2 C2.2 C3.1 C13.2 R2.1 R3.1(TOP) U1.2(VSS) U1.4(-IN)
IN-: P1.1
PA0/AN0: C1.1 R1.2 ; port PA0/AN0/PHOTODIODE_SENSE
NetC2_1: C2.1 P1.2 R2.2 U1.3(+IN)
NetC3_2: C3.2 R3.3(BOT)
NetR1_1: R1.1 U1.1(OUTPUT)

Not connected (* = marked no-connect by the designer): D1 1(A) 2(K); R3 2(TAP)

### Notes on the sheet
- (near D1) Photodiode
- (near C2) 100 pF
- (near C2) 50 V
- (near C3) 100 pF
- (near C3) 50 V
- Project:
- Title:
- Size:
- Project Lead:
- Letter
- Revision:
- University of Waterloo
- 200 University Ave W
- Waterloo, ON, Canada
- N2L 3E9
- Date:
- Sheet
- of
- Website:
- Labels drawn without touching a wire or pin: IN-
- (in symbol IC OP AMP GEN PURPOSE RR 10MHZ SOT-23-5) V+; +; GND; _

### Library data of the parts
C1 = CAP CER 1UF 50V 10% X7R 0603: as C11 on sheet Voltage Regulator; Supplier 1: Digi-Key; Supplier Part Number 1: 587-3247-1-ND; Packaging: Cut Tape (CT); Part Status: Active; Operating Temperature: -55°C ~ 125°C; Ratings: -; Mounting Type: Surface Mount, MLCC; Package / Case: 0603 (1608 Metric); Size / Dimension: 0.063" L x 0.031" W (1.60mm x 0.80mm); Height - Seated (Max): -; Thickness (Max): 0.037" (0.95mm); Lead Spacing: -; Lead Style: -; ComponentLink1URL: http://www.yuden.co.jp/productdata/catalog/en/mlcc_all_e.pdf; ComponentLink1Description: http://www.yuden.co.jp/productdata/catalog/en/mlcc_all_e.pdf; Tolerance: ±10%
C2 C3 = CAP CER 100PF 50V C0G/NP0 0603: 100pF ±1% 50V Ceramic Capacitor C0G, NP0 0603 (1608 Metric); Manufacturer: Kyocera AVX; Manufacturer Part Number: 06035A101FAT2A; Supplier 1: Digi-Key; Stock 1: 176069; Pricing 1: 1=0.24, 10=0.161, 100=0.0814, 500=0.0557, 1000=0.0493 (USD); Mount: Surface Mount; Case/Package: 0603; Case Code (Imperial): 0603; Case Code (Metric): 1608; Min Operating Temperature: -55°C; Max Operating Temperature: 125°C; Capacitance: 100pF; Tolerance: 1%; Packaging: Tape and Reel; Voltage Rating: 50V; Package Quantity: 1; Voltage Rating (DC): 50V; Termination: SMD/SMT; Voltage: 50V; Length: 1.6mm; Height: 0.86mm; Width: 0.81mm; Thickness: 0.035inch; Depth: 0.81mm; Radiation Hardening: No; REACH SVHC: No SVHC; Lead Free: Lead Free; ComponentLink1URL: https://datasheet.ciiva.com/22682/1796416-22682854.pdf; ComponentLink1Description: https://datasheet.ciiva.com/22682/1796416-22682854.pdf; ComponentLink2URL: https://datasheet.ciiva.com/150/ccog-150746.pdf; ComponentLink2Description: https://datasheet.ciiva.com/150/ccog-150746.pdf; ComponentLink3URL: https://datasheet.ciiva.com/150/ccog-150747.pdf; ComponentLink3Description: https://datasheet.ciiva.com/150/ccog-150747.pdf; ComponentLink4URL: https://datasheet.ciiva.com/150/ccog-150748.pdf; ComponentLink4Description: https://datasheet.ciiva.com/150/ccog-150748.pdf; ComponentLink5URL: https://datasheet.ciiva.com/28585/1796416-28585980.pdf; ComponentLink5Description: https://datasheet.ciiva.com/28585/1796416-28585980.pdf; ComponentLink6URL: https://datasheet.ciiva.com/16300/ccog-16300413.pdf; ComponentLink6Description: https://datasheet.ciiva.com/16300/ccog-16300413.pdf; ComponentLink7URL: https://datasheet.ciiva.com/17492/ccog-17492189.pdf; ComponentLink7Description: https://datasheet.ciiva.com/17492/ccog-17492189.pdf; Supplier Part Number 1: 478-6202-1-ND
  C2: Dielectric: C0G
C13 = CAP CER 0.1UF 50V 10% X7R 0603: as C7 on sheet Voltage Regulator; Supplier 1: Digi-Key; Supplier Part Number 1: 478-5052-1-ND; Packaging: Cut Tape (CT); Part Status: Active; Operating Temperature: -55°C ~ 125°C; Ratings: -; Mounting Type: Surface Mount, MLCC; Package / Case: 0603 (1608 Metric); Size / Dimension: 0.063" L x 0.032" W (1.60mm x 0.81mm); Height - Seated (Max): -; Thickness (Max): 0.035" (0.90mm); Lead Spacing: -; Lead Style: -; ComponentLink1URL: http://datasheets.avx.com/X7RDielectric.pdf; ComponentLink1Description: http://datasheets.avx.com/X7RDielectric.pdf; Tolerance: ±10%
D1 = DIODE 880NM W/FLTR THRUHOLE: Photodiode 880nm 20ns 120° 2-DIP (0.213", 5.40mm); Manufacturer: Osram Opto; Manufacturer Part Number: BPW34FA; Forward Current: 100mA; Reverse Breakdown Voltage: 32V; Forward Voltage: 1.3V; Max Power Dissipation: 150mW; Polarity: Reverse; Dark Current: 2nA; Diode Type: PIN; Max Reverse Voltage (DC): 16V; Supplier 1: Digi-Key; Stock 1: 7675; Pricing 1: 1=1.12, 10=0.867, 25=0.7188, 100=0.6195, 250=0.5452, 500=0.4708, 1000=0.3717, 2500=0.3469, 5000=0.3345 (USD); Mount: Through Hole,PCB; Case/Package: DIP; Number of Pins: 2; Contact Plating: Tin,Matte; Min Operating Temperature: -40°C; Max Operating Temperature: 100°C; Package Quantity: 1000; Wavelength: 880nm; Viewing Angle: 120°; Rise Time: 20ns; Packaging: Bulk; Fall Time: 20ns; Response Time: 20ns; Power Dissipation: 150mW; Reverse Voltage (DC): 16V; Length: 4.5mm; Height: 2.2mm; Width: 4mm; Radiation Hardening: No; REACH SVHC: No SVHC; ComponentLink1URL: https://datasheet.ciiva.com/1248/1672033-1248688.pdf; ComponentLink1Description: https://datasheet.ciiva.com/1248/1672033-1248688.pdf; ComponentLink2URL: https://datasheet.ciiva.com/4697/pw34fa-pb-free-2007-03-30-21826-4697664.pdf; ComponentLink2Description: https://datasheet.ciiva.com/4697/pw34fa-pb-free-2007-03-30-21826-4697664.pdf; ComponentLink3URL: https://datasheet.ciiva.com/1248/23915-1248689.pdf; ComponentLink3Description: https://datasheet.ciiva.com/1248/23915-1248689.pdf; ComponentLink4URL: https://datasheet.ciiva.com/4269/bpw34faleadpbfreeproduct-rohscompliant-4269826.pdf; ComponentLink4Description: https://datasheet.ciiva.com/4269/bpw34faleadpbfreeproduct-rohscompliant-4269826.pdf; ComponentLink5URL: https://datasheet.ciiva.com/15223/getdatasheetpartid-103433-15223260.pdf; ComponentLink5Description: https://datasheet.ciiva.com/15223/getdatasheetpartid-103433-15223260.pdf; ComponentLink6URL: https://datasheet.ciiva.com/2819/00100764-0-2819838.pdf; ComponentLink6Description: https://datasheet.ciiva.com/2819/00100764-0-2819838.pdf; Supplier Part Number 1: 475-1072-ND
P1 = CONN 2POS DURA-CLIK 0.079" VERT: 2 Positions Header, Shrouded Connector 0.079" (2.00mm) Surface Mount, Vertical Tin; Manufacturer: Molex, LLC; Manufacturer Part Number: 5600200220; Style: Board to Cable/Wire; Shrouding: Shrouded - 4 Wall; Number of Positions: 2; Number of Positions Loaded: All; Mated Stacking Heights: 9.3mm; Supplier 1: Digi-Key; RoHS: RoHS Compliant; Category: Connectors, Interconnects; Stock 1: 11912; Pricing 1: 1=1.16, 10=1.012, 25=0.952, 50=0.9122, 100=0.8727, 250=0.79336 (CAD); Packaging: Cut Tape (CT); Part Status: Active; Connector Type: Header; Contact Type: Male Pin; Pitch - Mating: 0.079" (2.00mm); Number of Rows: 1; Row Spacing - Mating: -; Mounting Type: Surface Mount; Termination: Solder; Fastening Type: Latch Lock; Contact Length - Mating: -; Contact Length - Post: -; Overall Contact Length: -; Insulation Height: 0.315" (8.00mm); Contact Shape: Square; Contact Finish - Mating: Tin; Contact Finish Thickness - Mating: -; Contact Finish - Post: Tin; Contact Material: Copper Alloy; Insulation Material: Polyamide (PA), Nylon; Features: Solder Retention; Operating Temperature: -; Ingress Protection: -; Material Flammability Rating: -; Insulation Color: Natural; Current Rating: -; Voltage Rating: -; Contact Finish Thickness - Post: -; Applications: Automotive, Industrial; ComponentLink1URL: http://www.molex.com/pdm_docs/sd/5600200220_sd.pdf; ComponentLink1Description: http://www.molex.com/pdm_docs/sd/5600200220_sd.pdf; Supplier Part Number 1: WM10862CT-ND
R1 = RES 120 OHM 1% 1/10W 0603: RES SMD 120 OHM 1% 1/10W 0603; Manufacturer 1: Yageo; Manufacturer Part Number 1: RC0603FR-07120RL; Temperature Coefficient: ±100ppm/°C; Supplier 1: Digi-Key; Supplier Part Number 1: 311-120HRCT-ND; Packaging: Cut Tape (CT); Part Status: Active; Composition: Thick Film; Operating Temperature: -55°C ~ 155°C; Package / Case: 0603 (1608 Metric); Supplier Device Package: 0603; Size / Dimension: 0.063" L x 0.031" W (1.60mm x 0.80mm); Height - Seated (Max): 0.022" (0.55mm); Failure Rate: -; ComponentLink1URL: http://www.yageo.com/documents/recent/PYu-RC_Group_51_RoHS_L_7.pdf; ComponentLink1Description: http://www.yageo.com/documents/recent/PYu-RC_Group_51_RoHS_L_7.pdf
R2 = RES 4.7K OHM 1% 1/10W 0603: as R11 on sheet Voltage Regulator; Supplier 1: Digi-Key; Supplier Part Number 1: 311-4.70KHRCT-ND; RoHS: RoHS Compliant; Category: Resistors; Stock 1: 3487566; Pricing 1: 1=0.16, 10=0.022, 100=0.0089, 1000=0.00402, 2500=0.00349 (CAD); Packaging: Cut Tape (CT); Part Status: Active; Composition: Thick Film; Features: Moisture Resistant; Operating Temperature: -55°C ~ 155°C; Package / Case: 0603 (1608 Metric); Supplier Device Package: 0603; Size / Dimension: 0.063" L x 0.031" W (1.60mm x 0.80mm); Height - Seated (Max): 0.022" (0.55mm); Failure Rate: -; ComponentLink1URL: http://www.yageo.com/documents/recent/PYu-RC_Group_51_RoHS_L_7.pdf; ComponentLink1Description: http://www.yageo.com/documents/recent/PYu-RC_Group_51_RoHS_L_7.pdf; Tolerance: ±1%
R3 = POT 500K OHM 0.25W SMD: 500 kOhms 0.25W, 1/4W J Lead Surface Mount Trimmer Potentiometer Cermet 11 Turn Top Adjustment; Manufacturer: Nidec Copal; Manufacturer Part Number: SM-42TW504; Number of Turns: 11; Temperature Coefficient: 100ppm/°C; Supplier 1: Digi-Key; Stock 1: 1022; Pricing 1: 1=3.4, 10=2.979, 25=2.66, 50=2.5004, 100=2.4472 (USD); Mount: Surface Mount; Min Operating Temperature: -65°C; Max Operating Temperature: 150°C; Package Quantity: 1; Packaging: Tape and Reel; Composition: Cermet; Length: 0.189inch; Height: 0.201inch; Width: 0.138inch; Radiation Hardening: No; ComponentLink1URL: https://datasheet.ciiva.com/2158/sm-42sm-43-2158256.pdf; ComponentLink1Description: https://datasheet.ciiva.com/2158/sm-42sm-43-2158256.pdf; ComponentLink2URL: https://datasheet.ciiva.com/2158/sm-42sm-43-2158257.pdf; ComponentLink2Description: https://datasheet.ciiva.com/2158/sm-42sm-43-2158257.pdf; ComponentLink3URL: https://datasheet.ciiva.com/2158/sm-42sm-43-2158255.pdf; ComponentLink3Description: https://datasheet.ciiva.com/2158/sm-42sm-43-2158255.pdf; Supplier Part Number 1: SM-42TW504CT-ND
U1 = IC OP AMP GEN PURPOSE RR 10MHZ SOT-23-5: as U5 on sheet Voltage Regulator; Supplier 1: Digi-Key; Supplier Part Number 1: 296-45323-1-ND; RoHS: RoHS Compliant; Category: Integrated Circuits (ICs); Stock 1: 1747; Pricing 1: 1=1.33, 10=1.185, 100=0.9234, 500=0.76276, 1000=0.60218 (CAD); Packaging: Cut Tape (CT); Part Status: Active; Amplifier Type: General Purpose; Output Type: Rail-to-Rail; -3db Bandwidth: -; Operating Temperature: -40°C ~ 125°C; Mounting Type: Surface Mount; Package / Case: SC-74A, SOT-753; Supplier Device Package: SOT-23-5; ComponentLink1URL: http://www.ti.com/lit/ds/symlink/tlv316-q1.pdf; ComponentLink1Description: http://www.ti.com/lit/ds/symlink/tlv316-q1.pdf

## Sheet Connectors.SchDoc
size Letter
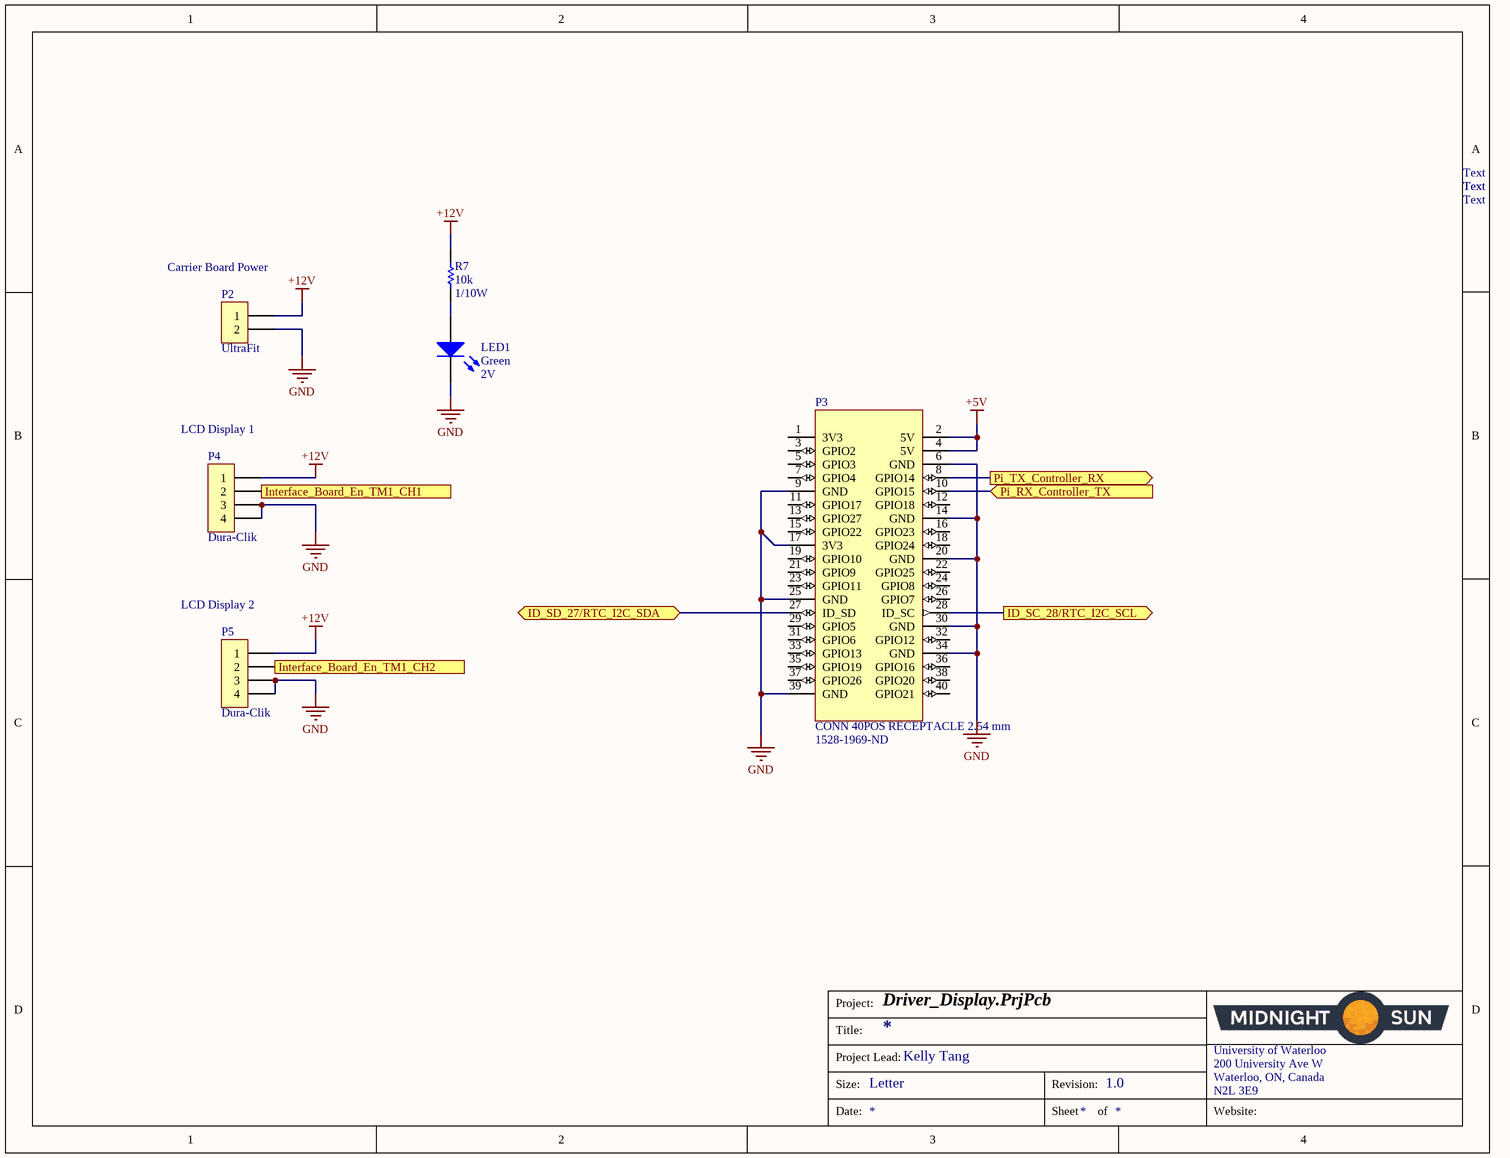
[diagram p4: Connectors.SchDoc]

### Parts
LED1  Color: Green  Voltage - Forward (Vf) (Typ): 2V  [LED_0603]  (hidden comment: LED GREEN CLEAR 2V 0603)
P2  Series: UltraFit  [CONN, 2POS ULTRA-FIT]  (hidden comment: CONN 2POS ULTRA-FIT 0.138")
P3  CONN 40POS RECEPTACLE 2.54 mm  Supplier Part Number 1: 1528-1969-ND  [CONN 40POS RECEPTACLE 2.54 MM]
P4  Dura-Clik  [CONN, 4POS DURA-CLIK VERT]
P5  Dura-Clik  [CONN, 4POS DURA-CLIK VERT]
R7  Resistance: 10k  Power: 1/10W  [RES, 0603]  (hidden comment: RES 10K OHM 1% 1/10W 0603)

### Ports
ID_SC_28/RTC_I2C_SCL (out), ID_SD_27/RTC_I2C_SDA (bidir), Interface_Board_En_TM1_CH1 (out), Interface_Board_En_TM1_CH2 (out), Pi_RX_Controller_TX (in), Pi_TX_Controller_RX (out)

### Nets
+5V: P3.2(5V) P3.4(5V)
+12V: P2.1 P4.1 P5.1 R7.2
GND: LED1.2(K) P2.2 P3.6(GND) P3.9(GND) P3.14(GND) P3.17(3V3) P3.20(GND) P3.25(GND) P3.30(GND) P3.34(GND) P3.39(GND) P4.3 P4.4 P5.3 P5.4
PA8: P4.2 ; port Interface_Board_En_TM1_CH1
PA9: P5.2 ; port Interface_Board_En_TM1_CH2
PB10/USART3_TX/I2C2_SCL: P3.10(GPIO15) ; port Pi_RX_Controller_TX
PB11/USART3_RX/I2C2_SDA: P3.8(GPIO14) ; port Pi_TX_Controller_RX
NetLED1_1: LED1.1(A) R7.1
NetP3_27: P3.27(ID_SD) ; port ID_SD_27/RTC_I2C_SDA
NetP3_28: P3.28(ID_SC) ; port ID_SC_28/RTC_I2C_SCL

Not connected (* = marked no-connect by the designer): P3 1(3V3) 3(GPIO2) 5(GPIO3) 7(GPIO4) 11(GPIO17) 12(GPIO18) 13(GPIO27) 15(GPIO22) 16(GPIO23) 18(GPIO24) 19(GPIO10) 21(GPIO9) 22(GPIO25) 23(GPIO11) 24(GPIO8) 26(GPIO7) 29(GPIO5) 31(GPIO6) 32(GPIO12) 33(GPIO13) 35(GPIO19) 36(GPIO16) 37(GPIO26) 38(GPIO20) 40(GPIO21)

### Notes on the sheet
- Text
- (near P2) Carrier Board Power
- (near P4) LCD Display 1
- (near P5) LCD Display 2
- Project:
- Title:
- Size:
- Project Lead:
- Letter
- Revision:
- University of Waterloo
- 200 University Ave W
- Waterloo, ON, Canada
- N2L 3E9
- Date:
- Sheet
- of
- Website:

### Library data of the parts
LED1 = LED GREEN CLEAR 2V 0603: Green 572nm LED Indication - Discrete 2V 0603 (1608 Metric); Manufacturer: Wurth Electronics Inc.; Manufacturer Part Number: 150060VS75000; Lens Color: Colorless; Millicandela Rating: 40mcd; Lens Style/Size: Rectangle with Flat Top, 1.10mm x 0.70mm; Current - Test: 20mA; Viewing Angle: 140°; Wavelength - Dominant: 570nm; Supplier 1: Digi-Key; RoHS: RoHS Compliant; Category: Optoelectronics; Stock 1: 9408; Pricing 1: 1=0.21, 100=0.1617, 500=0.13964 (CAD); Packaging: Cut Tape (CT); Part Status: Active; Lens Transparency: Clear; Mounting Type: Surface Mount; Wavelength - Peak: 572nm; Features: -; Package / Case: 0603 (1608 Metric); Supplier Device Package: 0603; Size / Dimension: 1.60mm L x 0.80mm W; Height (Max): 0.80mm; ComponentLink1URL: http://katalog.we-online.de/led/datasheet/150060VS75000.pdf; ComponentLink1Description: http://katalog.we-online.de/led/datasheet/150060VS75000.pdf; Supplier Part Number 1: 732-4980-1-ND
P2 = CONN 2POS ULTRA-FIT 0.138": 2 Positions Header, Shrouded Connector 0.138" (3.50mm) Through Hole Gold; Manufacturer 1: Molex, LLC; Manufacturer Part Number 1: 1722861302; Style: Board to Board or Cable; Shrouding: Shrouded - 4 Wall; Number of Positions: 2; Number of Positions Loaded: All; Contact Length - Post: 0.126" (3.20mm); Material Flammability Rating: UL94 V-0; Mated Stacking Heights: 26.99mm; Voltage: 400V; Supplier 1: Digi-Key; Supplier Part Number 1: WM11673-ND; Packaging: Tray; Part Status: Active; Connector Type: Header; Contact Type: Male Pin; Pitch - Mating: 0.138" (3.50mm); Number of Rows: 1; Row Spacing - Mating: -; Mounting Type: Through Hole; Termination: Kinked Pin, Solder; Fastening Type: Latch Holder; Contact Length - Mating: -; Overall Contact Length: -; Insulation Height: 0.465" (11.80mm); Contact Shape: Square; Contact Finish - Mating: Gold; Contact Finish Thickness - Mating: 30µin (0.76µm); Contact Finish - Post: Tin; Contact Material: Copper Alloy; Insulation Material: Liquid Crystal Polymer (LCP); Operating Temperature: -40°C ~ 120°C; Ingress Protection: -; Insulation Color: Black; Current Rating: -; Contact Finish Thickness - Post: 60µin (1.52µm); ComponentLink1URL: http://www.molex.com/pdm_docs/sd/1722861302_sd.pdf; ComponentLink1Description: http://www.molex.com/pdm_docs/sd/1722861302_sd.pdf
P3 = CONN 40POS RECEPTACLE 2.54 mm: GPIO HEADER FOR RASPBERRYPI A+/B; Manufacturer: Adafruit Industries; Manufacturer Part Number: 1992; Supplier 1: Digi-Key; Stock 1: 175; Pricing 1: 1=2.95 (USD); ComponentLink1Description: gpio header raspberry pi; ComponentLink1URL: https://www.digikey.ca/product-detail/en/adafruit-industries-llc/1992/1528-1969-ND/6827092
P4 P5 = CONN 4POS DURA-CLIK 0.079": 4 Positions Header Connector 0.079" (2.00mm) Surface Mount Tin; Manufacturer: Molex, LLC; Manufacturer Part Number: 5600200420; Style: Board to Cable/Wire; Shrouding: Shrouded - 4 Wall; Number of Positions: 4; Number of Positions Loaded: All; Mated Stacking Heights: 9.3mm; Supplier 1: Digi-Key; RoHS: RoHS Compliant; Category: Connectors, Interconnects; Stock 1: 9367; Pricing 1: 1=2.23, 10=2.022, 25=1.898, 50=1.8156, 100=1.733 (CAD); Packaging: Cut Tape (CT); Part Status: Active; Connector Type: Header; Contact Type: Male Pin; Pitch - Mating: 0.079" (2.00mm); Number of Rows: 1; Row Spacing - Mating: -; Mounting Type: Surface Mount; Termination: Solder; Fastening Type: Latch Lock; Contact Length - Mating: -; Contact Length - Post: -; Overall Contact Length: -; Insulation Height: 0.315" (8.00mm); Contact Shape: Square; Contact Finish - Mating: Tin; Contact Finish Thickness - Mating: -; Contact Finish - Post: Tin; Contact Material: Copper Alloy; Insulation Material: Polyamide (PA), Nylon; Features: Solder Retention; Operating Temperature: -; Ingress Protection: -; Material Flammability Rating: -; Insulation Color: Natural; Current Rating: -; Voltage Rating: -; Contact Finish Thickness - Post: -; Applications: Automotive, Industrial; ComponentLink1URL: http://www.molex.com/pdm_docs/sd/5600200420_sd.pdf; ComponentLink1Description: http://www.molex.com/pdm_docs/sd/5600200420_sd.pdf; Supplier Part Number 1: WM10864CT-ND
R7 = RES 10K OHM 1% 1/10W 0603: as R9 on sheet Voltage Regulator; Supplier 1: Digi-Key; Supplier Part Number 1: 311-10.0KHRCT-ND; Packaging: Cut Tape (CT); Part Status: Active; Composition: Thick Film; Operating Temperature: -55°C ~ 155°C; Package / Case: 0603 (1608 Metric); Supplier Device Package: 0603; Size / Dimension: 0.063" L x 0.031" W (1.60mm x 0.80mm); Height - Seated (Max): 0.022" (0.55mm); Failure Rate: -; ComponentLink1URL: http://www.yageo.com/documents/recent/PYu-RC_Group_51_RoHS_L_7.pdf; ComponentLink1Description: http://www.yageo.com/documents/recent/PYu-RC_Group_51_RoHS_L_7.pdf; Tolerance: ±1%